# Altium project MBLv1.PrjPcb
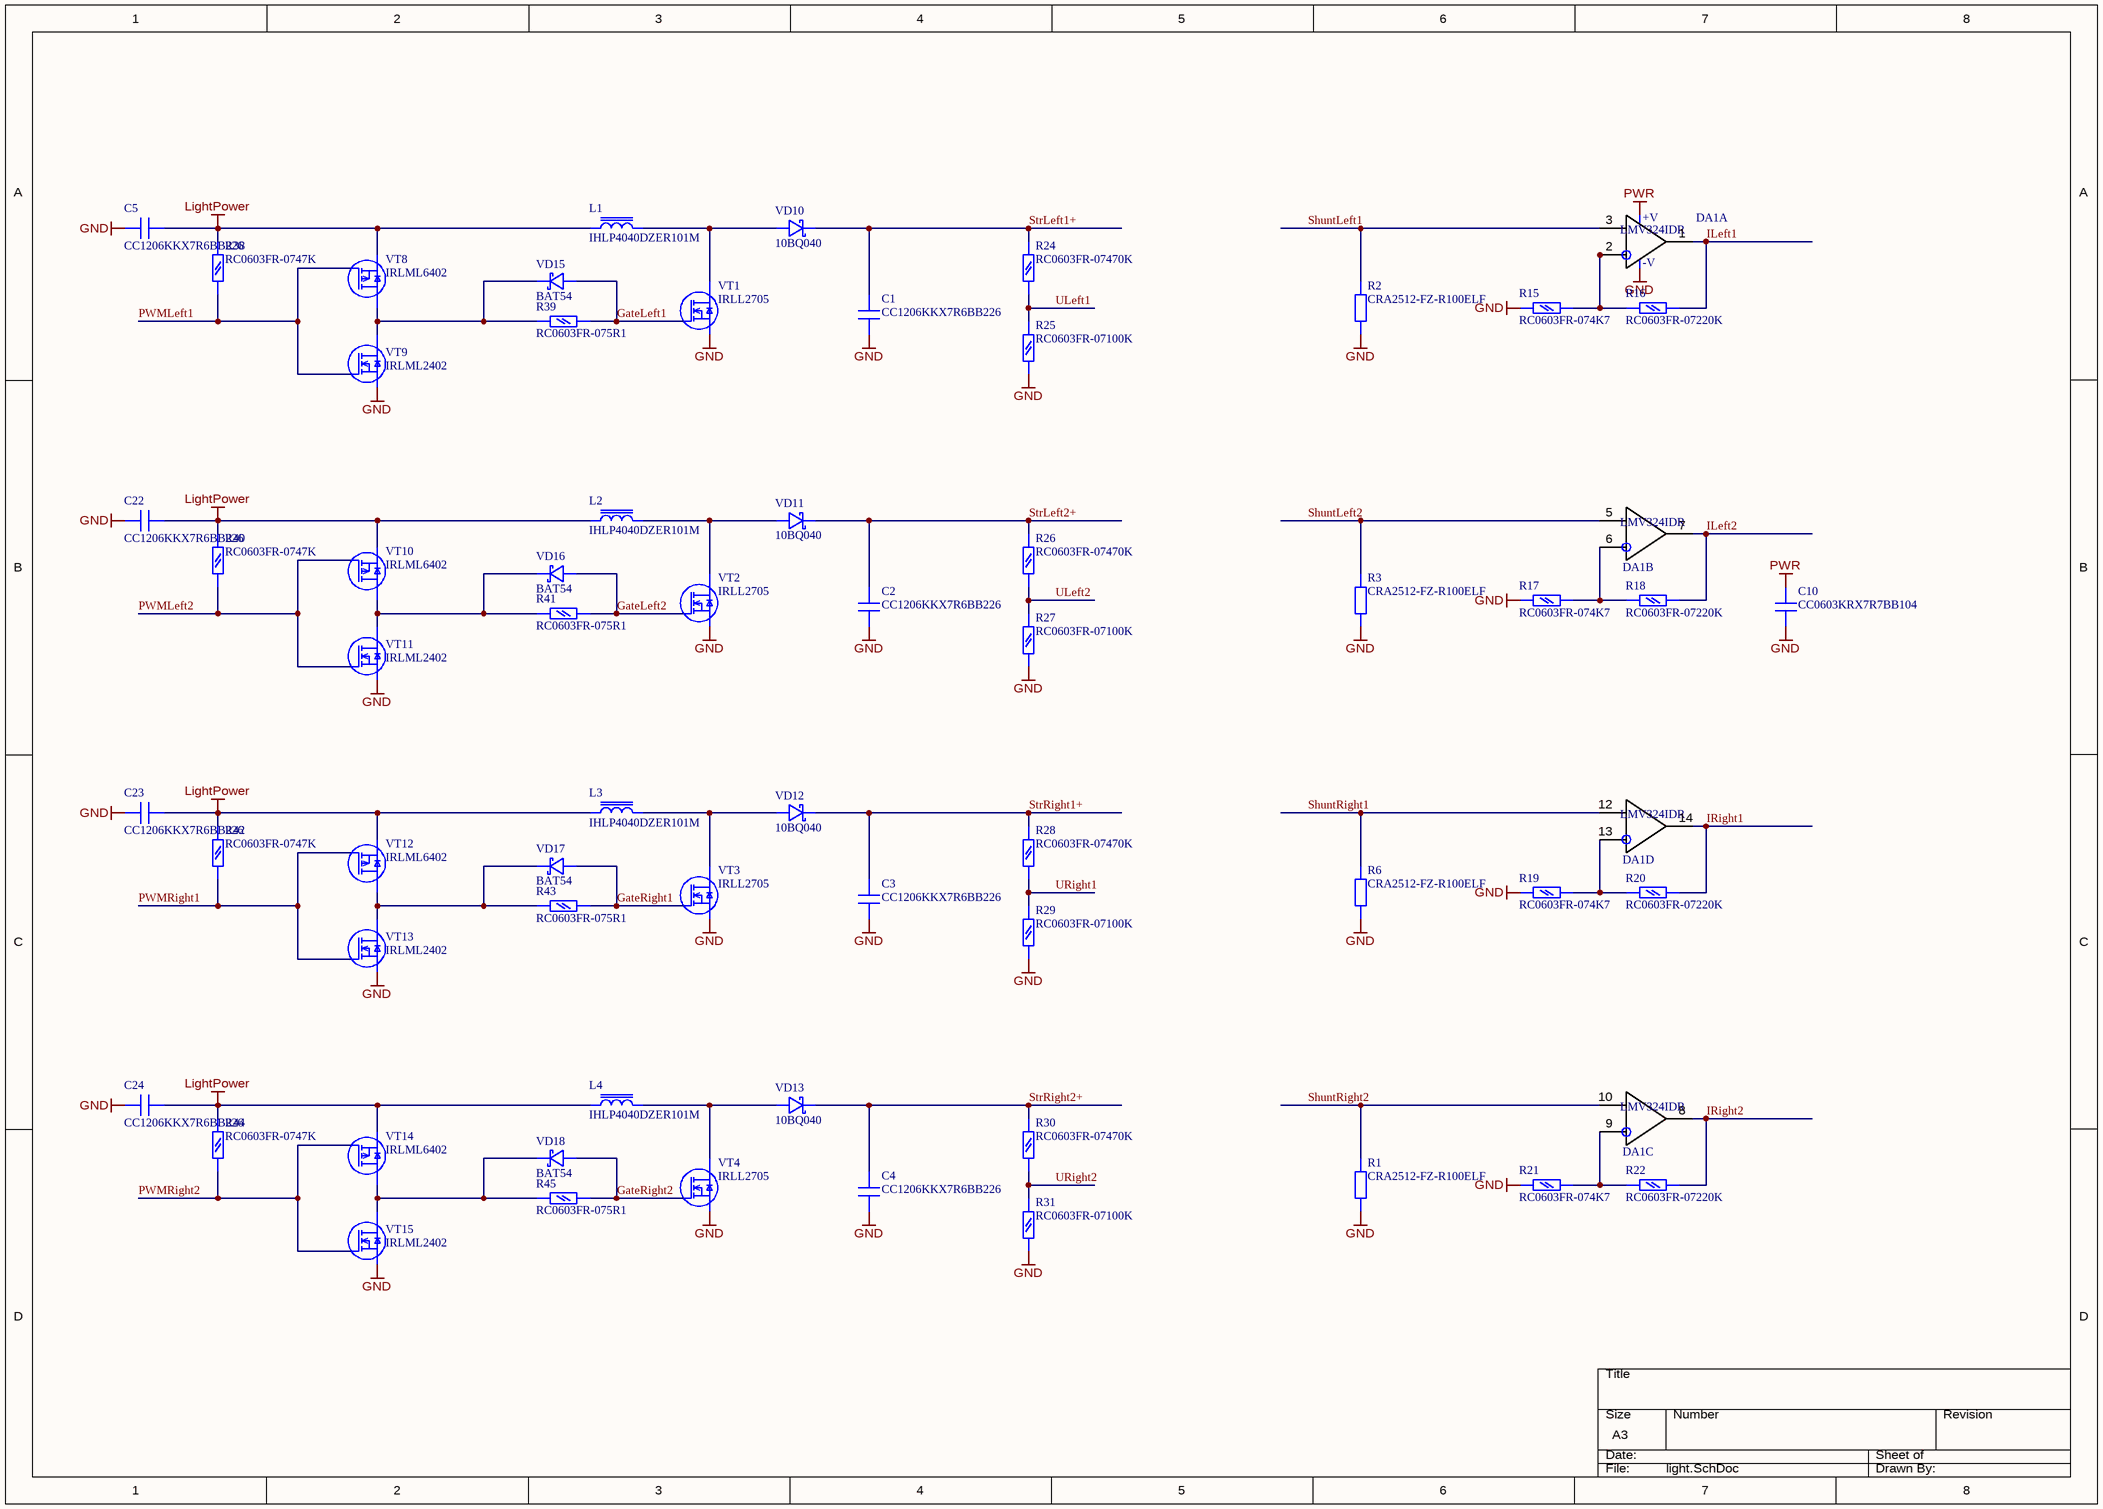
[diagram p0: light.SchDoc]
3 sheets, 110 parts. Net scope: global (net labels, ports and power ports of the same name join across sheets).
Board file: MBLv1.PcbDoc
Sheets:
  light.SchDoc
  control.SchDoc
  charger.SchDoc

## Sheet light.SchDoc
size A3

### Parts
C1  CC1206KKX7R6BB226  [CapacitorSMD1206(reflow)]
C2  CC1206KKX7R6BB226  [CapacitorSMD1206(reflow)]
C3  CC1206KKX7R6BB226  [CapacitorSMD1206(reflow)]
C4  CC1206KKX7R6BB226  [CapacitorSMD1206(reflow)]
C5  CC1206KKX7R6BB226  [CapacitorSMD1206(reflow)]
C10  CC0603KRX7R7BB104  [CapacitorSMD0603(manual)]
C22  CC1206KKX7R6BB226  [CapacitorSMD1206(reflow)]
C23  CC1206KKX7R6BB226  [CapacitorSMD1206(reflow)]
C24  CC1206KKX7R6BB226  [CapacitorSMD1206(reflow)]
DA1  LMV324IDR  [SO14]  (parts A,B,C,D of 4)
L1  IHLP4040DZER101M  [IHLP-4040DZ(manual/deep1.5mm)]
L2  IHLP4040DZER101M  [IHLP-4040DZ(manual/deep1.5mm)]
L3  IHLP4040DZER101M  [IHLP-4040DZ(manual/deep1.5mm)]
L4  IHLP4040DZER101M  [IHLP-4040DZ(manual/deep1.5mm)]
R1  CRA2512-FZ-R100ELF  [ResistorSMD2512(reflow)]
R2  CRA2512-FZ-R100ELF  [ResistorSMD2512(reflow)]
R3  CRA2512-FZ-R100ELF  [ResistorSMD2512(reflow)]
R6  CRA2512-FZ-R100ELF  [ResistorSMD2512(reflow)]
R15  RC0603FR-074K7  [ResistorSMD0603(manual)]
R16  RC0603FR-07220K  [ResistorSMD0603(manual)]
R17  RC0603FR-074K7  [ResistorSMD0603(manual)]
R18  RC0603FR-07220K  [ResistorSMD0603(manual)]
R19  RC0603FR-074K7  [ResistorSMD0603(manual)]
R20  RC0603FR-07220K  [ResistorSMD0603(manual)]
R21  RC0603FR-074K7  [ResistorSMD0603(manual)]
R22  RC0603FR-07220K  [ResistorSMD0603(manual)]
R24  RC0603FR-07470K  [ResistorSMD0603(manual)]
R25  RC0603FR-07100K  [ResistorSMD0603(manual)]
R26  RC0603FR-07470K  [ResistorSMD0603(manual)]
R27  RC0603FR-07100K  [ResistorSMD0603(manual)]
R28  RC0603FR-07470K  [ResistorSMD0603(manual)]
R29  RC0603FR-07100K  [ResistorSMD0603(manual)]
R30  RC0603FR-07470K  [ResistorSMD0603(manual)]
R31  RC0603FR-07100K  [ResistorSMD0603(manual)]
R38  RC0603FR-0747K  [ResistorSMD0603(manual)]
R39  RC0603FR-075R1  [ResistorSMD0603(manual)]
R40  RC0603FR-0747K  [ResistorSMD0603(manual)]
R41  RC0603FR-075R1  [ResistorSMD0603(manual)]
R42  RC0603FR-0747K  [ResistorSMD0603(manual)]
R43  RC0603FR-075R1  [ResistorSMD0603(manual)]
R44  RC0603FR-0747K  [ResistorSMD0603(manual)]
R45  RC0603FR-075R1  [ResistorSMD0603(manual)]
VD10  10BQ040  [SMB_10BQ40]
VD11  10BQ040  [SMB_10BQ40]
VD12  10BQ040  [SMB_10BQ40]
VD13  10BQ040  [SMB_10BQ40]
VD15  BAT54  [SOT23]
VD16  BAT54  [SOT23]
VD17  BAT54  [SOT23]
VD18  BAT54  [SOT23]
VT1  IRLL2705  [SOT223]
VT2  IRLL2705  [SOT223]
VT3  IRLL2705  [SOT223]
VT4  IRLL2705  [SOT223]
VT8  IRLML6402  [SOT23]
VT9  IRLML2402  [SOT23]
VT10  IRLML6402  [SOT23]
VT11  IRLML2402  [SOT23]
VT12  IRLML6402  [SOT23]
VT13  IRLML2402  [SOT23]
VT14  IRLML6402  [SOT23]
VT15  IRLML2402  [SOT23]

### Nets
GND: C1.1 C2.1 C3.1 C4.1 C5.2 C10.1 C22.2 C23.2 C24.2 DA1.11 R1.1 R2.1 R3.1 R6.1 R15.1 R17.1 R19.1 R21.1 R25.1 R27.1 R29.1 R31.1 VT1.3(S) VT2.3(S) VT3.3(S) VT4.3(S) VT9.2(S) VT11.2(S) VT13.2(S) VT15.2(S)
LightPower: C5.1 C22.1 C23.1 C24.1 L1.1 L2.1 L3.1 L4.1 R38.1 R40.1 R42.1 R44.1 VT8.2(S) VT10.2(S) VT12.2(S) VT14.2(S)
PWR: C10.2 DA1.4
GateLeft1: R39.1 VD15.1 VT1.1(G)
GateLeft2: R41.1 VD16.1 VT2.1(G)
GateRight1: R43.1 VD17.1 VT3.1(G)
GateRight2: R45.1 VD18.1 VT4.1(G)
ILeft1: DA1.1 R16.2
ILeft2: DA1.7 R18.2
IRight1: DA1.14 R20.2
IRight2: DA1.8 R22.2
PWMLeft1: R38.2 VT8.1(G) VT9.1(G)
PWMLeft2: R40.2 VT10.1(G) VT11.1(G)
PWMRight1: R42.2 VT12.1(G) VT13.1(G)
PWMRight2: R44.2 VT14.1(G) VT15.1(G)
ShuntLeft1: DA1.3 R2.2
ShuntLeft2: DA1.5 R3.2
ShuntRight1: DA1.12 R6.2
ShuntRight2: DA1.10 R1.2
StrLeft1+: C1.2 R24.2 VD10.2
StrLeft2+: C2.2 R26.2 VD11.2
StrRight1+: C3.2 R28.2 VD12.2
StrRight2+: C4.2 R30.2 VD13.2
ULeft1: R24.1 R25.2
ULeft2: R26.1 R27.2
URight1: R28.1 R29.2
URight2: R30.1 R31.2
NetDA1_2: DA1.2 R15.2 R16.1
NetDA1_6: DA1.6 R17.2 R18.1
NetDA1_9: DA1.9 R21.2 R22.1
NetDA1_13: DA1.13 R19.2 R20.1
NetL1_2: L1.2 VD10.1 VT1.2(D)
NetL2_2: L2.2 VD11.1 VT2.2(D)
NetL3_2: L3.2 VD12.1 VT3.2(D)
NetL4_2: L4.2 VD13.1 VT4.2(D)
NetR39_2: R39.2 VD15.3 VT8.3(D) VT9.3(D)
NetR41_2: R41.2 VD16.3 VT10.3(D) VT11.3(D)
NetR43_2: R43.2 VD17.3 VT12.3(D) VT13.3(D)
NetR45_2: R45.2 VD18.3 VT14.3(D) VT15.3(D)

### Notes on the sheet
- (in symbol OpAmp_Quad_SO14, part A) +V; -V

### Library data of the parts
C1-C5 C22-C24 = CapacitorSMD1206(reflow): CAPACITOR Capacitor SMD 1206 3.2x1.6mm; Описание: Конденсатор SMD 1206; NumberSolderPointsSMD: 0; Аналог: нет; NumberSolderPointsTHT: 0
C10 = CapacitorSMD0603(reflow): CAPACITOR Capacitor SMD 0603 1.6x0.8mm; Описание: Конденсатор SMD 0603; NumberSolderPointsSMD: 0; Аналог: нет; NumberSolderPointsTHT: 0
DA1 = OpAmp_Quad_SO14: IC generic quad op amp SO14; Описание: Микросхема SO14; NumberSolderPointsSMD: 0; Аналог: нет; NumberSolderPointsTHT: 0; x: LMV324ID
L1-L4 = IHLP-4040DZ: MAGNETIC Inductor SMD 4040 h=4mm; Описание: Индуктивность SMD 2525; NumberSolderPointsSMD: 0; Аналог: нет; NumberSolderPointsTHT: 0
R1-R3 R6 = ResistorSMD2512(reflow): RESISTOR Resistor SMD 2512 6.35x3.2mm; Описание: Резистор SMD 2512; NumberSolderPointsSMD: 0; Аналог: нет; NumberSolderPointsTHT: 0
R15-R22 R24-R31 R38-R45 = ResistorSMD0603(reflow): RESISTOR Resistor SMD 0603 1.6x0.8mm; Описание: Резистор SMD 0603; NumberSolderPointsSMD: 0; Аналог: нет; NumberSolderPointsTHT: 0
VD10-VD13 = 10BQ___: DIODE Schottky rectifier; Описание: Диод SMB; NumberSolderPointsSMD: 0; Аналог: нет; x: 10bq015/030/040/060/100; NumberSolderPointsTHT: 0
VD15-VD18 = BAT54: DIODE Schottky barrier diodes; Описание: Диод SOT23; NumberSolderPointsSMD: 0; Аналог: нет; NumberSolderPointsTHT: 0; x: *
VT1-VT4 = MOSFET_N_SOT223: TRANSISTOR MOSFET N generic sot23; Описание: Транзистор SOT223; NumberSolderPointsSMD: 0; Аналог: нет; x: IRLL2705(55v,3.8A,0.04ohm); NumberSolderPointsTHT: 0
VT8 VT10 VT12 VT14 = MOSFET_P_sot23: TRANSISTOR MOSFET P generic sot23; Описание: Транзистор SOT23; NumberSolderPointsSMD: 0; Аналог: нет; NumberSolderPointsTHT: 0; x: IRLML6402
VT9 VT11 VT13 VT15 = MOSFET_N_sot23: TRANSISTOR MOSFET N generic sot23; Описание: Транзистор SOT23; NumberSolderPointsSMD: 0; Аналог: нет; NumberSolderPointsTHT: 0; x: IRLML2402

## Sheet control.SchDoc
size A3
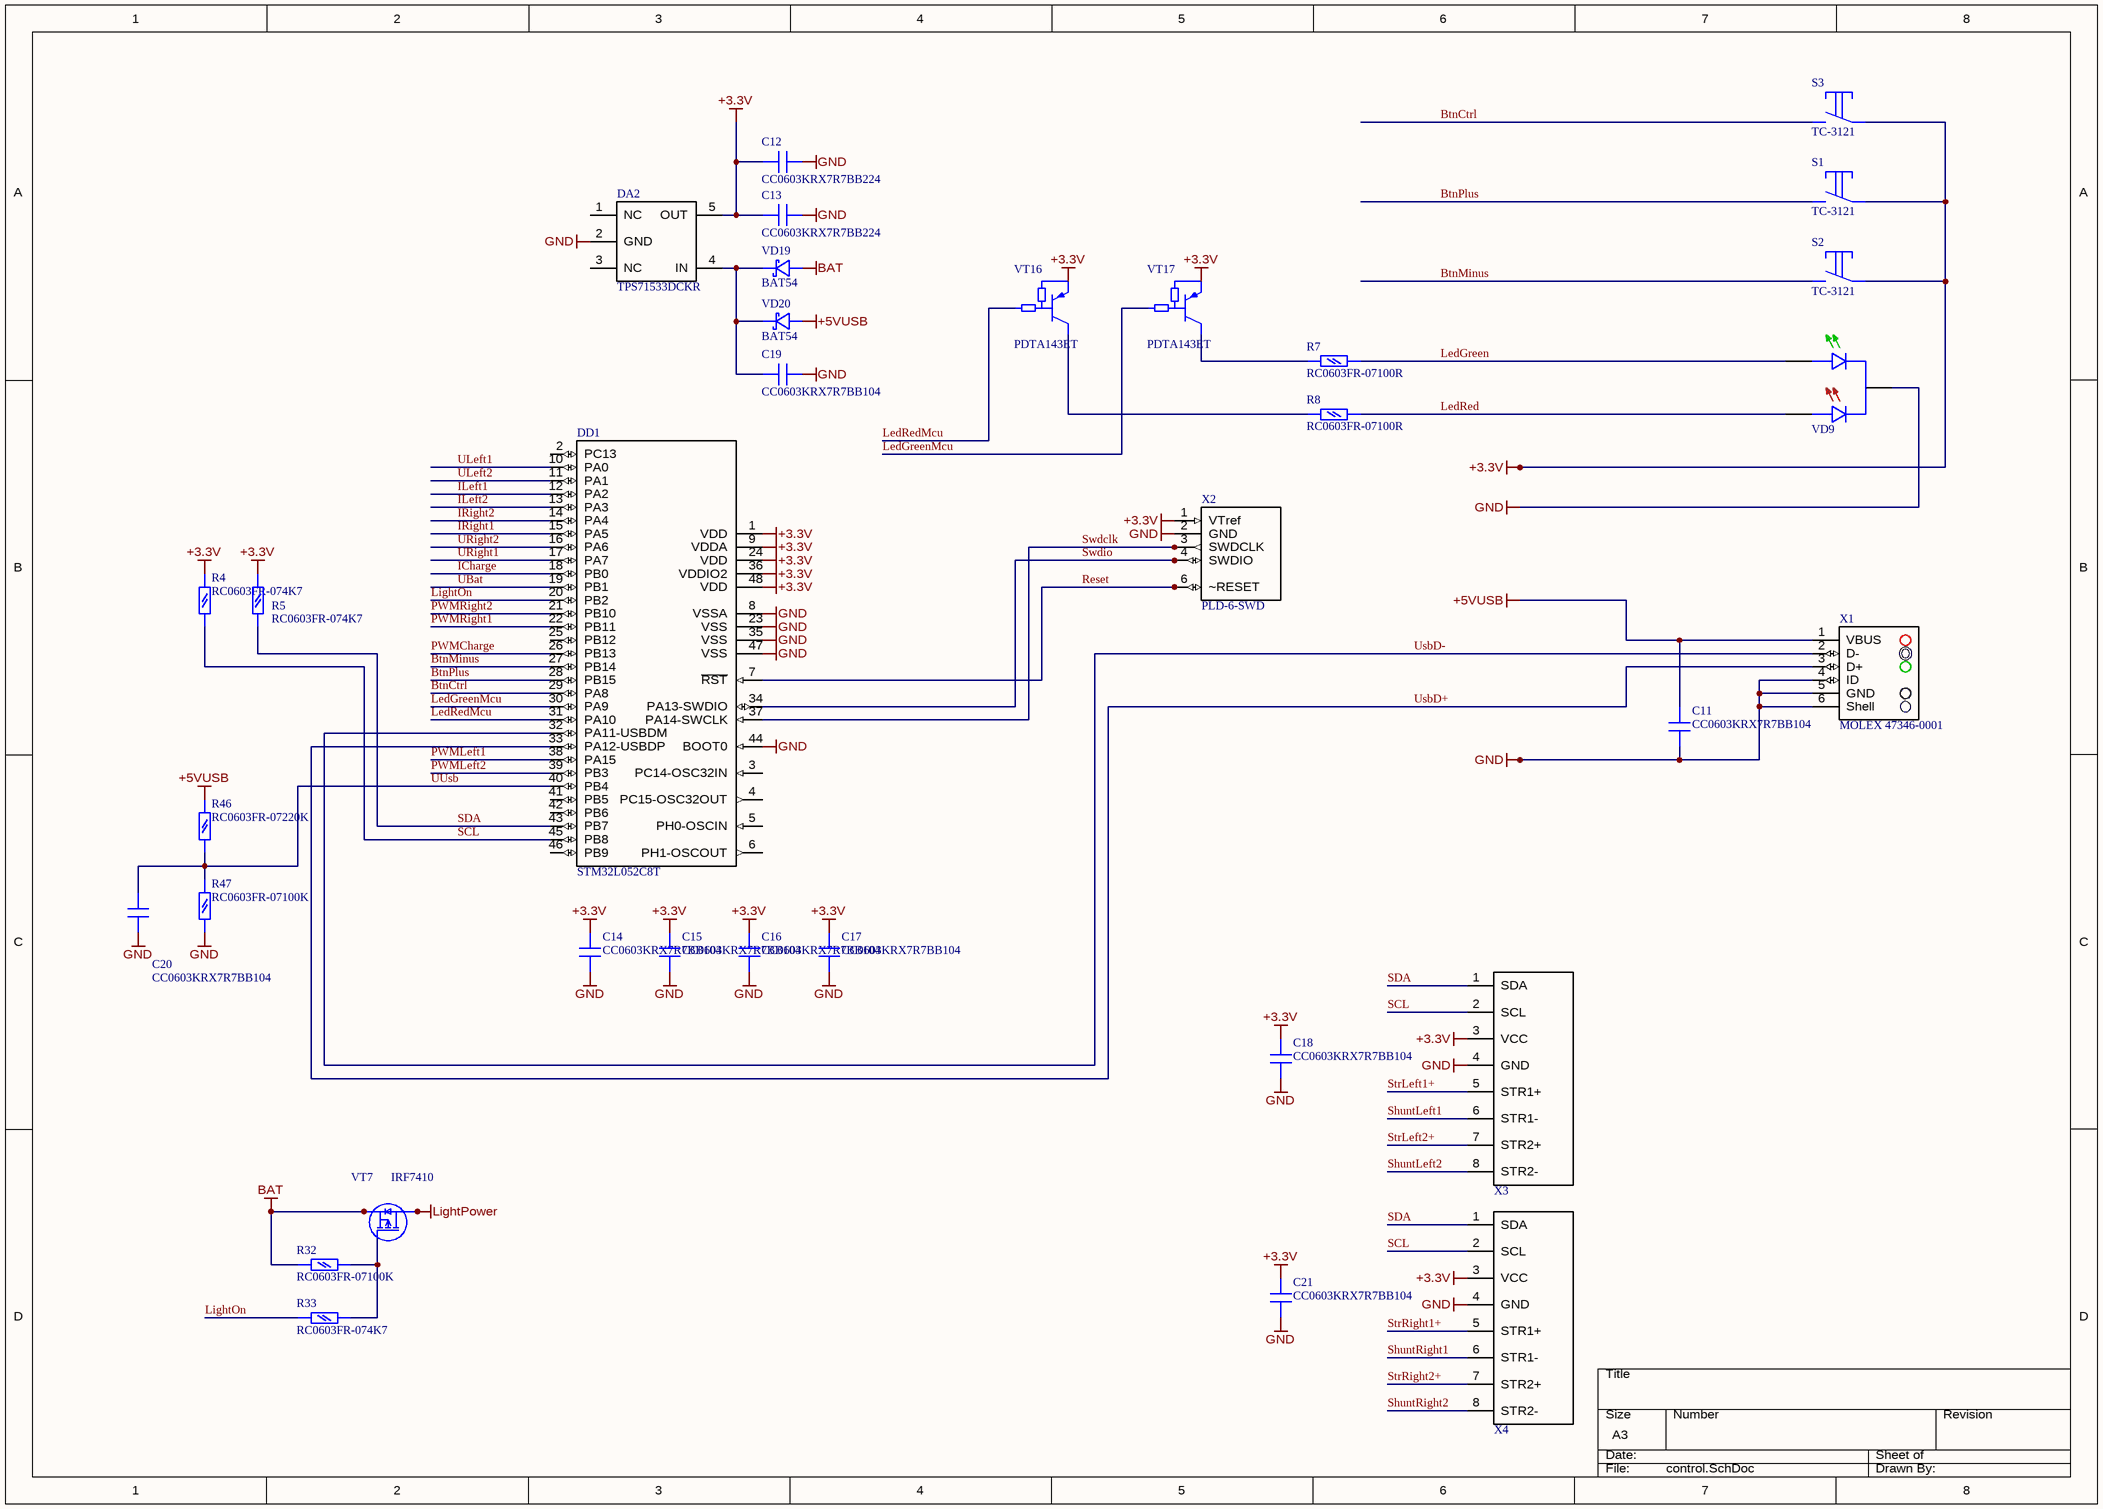
[diagram p1: control.SchDoc]

### Parts
C11  CC0603KRX7R7BB104  [CapacitorSMD0603(manual)]
C12  CC0603KRX7R7BB224  [CapacitorSMD0603(manual)]
C13  CC0603KRX7R7BB224  [CapacitorSMD0603(manual)]
C14  CC0603KRX7R7BB104  [CapacitorSMD0603(manual)]
C15  CC0603KRX7R7BB104  [CapacitorSMD0603(manual)]
C16  CC0603KRX7R7BB104  [CapacitorSMD0603(manual)]
C17  CC0603KRX7R7BB104  [CapacitorSMD0603(manual)]
C18  CC0603KRX7R7BB104  [CapacitorSMD0603(manual)]
C19  CC0603KRX7R7BB104  [CapacitorSMD0603(manual)]
C20  CC0603KRX7R7BB104  [CapacitorSMD0603(manual)]
C21  CC0603KRX7R7BB104  [CapacitorSMD0603(manual)]
DA2  TPS71533DCKR  [SOT323-5]
DD1  STM32L052C8T  [LQFP48_STM32]
R4  RC0603FR-074K7  [ResistorSMD0603(manual)]
R5  RC0603FR-074K7  [ResistorSMD0603(manual)]
R7  RC0603FR-07100R  [ResistorSMD0603(manual)]
R8  RC0603FR-07100R  [ResistorSMD0603(manual)]
R32  RC0603FR-07100K  [ResistorSMD0603(manual)]
R33  RC0603FR-074K7  [ResistorSMD0603(manual)]
R46  RC0603FR-07220K  [ResistorSMD0603(manual)]
R47  RC0603FR-07100K  [ResistorSMD0603(manual)]
S1  TC-3121  [TC-3121(right-angle var1)]
S2  TC-3121  [TC-3121(right-angle var1)]
S3  TC-3121  [TC-3121(right-angle var1)]
VD9  L-119EGWT  [L-119EGWT(rightAngleVar1)]  (value not drawn)
VD19  BAT54  [SOT23]
VD20  BAT54  [SOT23]
VT7  IRF7410  [SO8]
VT16  PDTA143ET  [SOT23]
VT17  PDTA143ET  [SOT23]
X1  MOLEX 47346-0001  [MOLEX 47346-0001]
X2  PLD-6-SWD  [PLD-6-SWD]  (no BOM)
X3  ConnectorMainSide  [ConnectorMainSide]  (value not drawn)  (no BOM)
X4  ConnectorMainSide  [ConnectorMainSide]  (value not drawn)  (no BOM)

### Nets
+3.3V: C12.2 C13.2 C14.2 C15.2 C16.2 C17.2 C18.2 C21.2 DA2.5(OUT) DD1.1(VDD) DD1.9(VDDA) DD1.24(VDD) DD1.36(VDDIO2) DD1.48(VDD) R4.1 R5.1 S1.2 S2.2 S3.2 VT16.2 VT17.2 X2.1(VTref) X3.3(VCC) X4.3(VCC)
+5VUSB: C11.2 R46.1 VD20.1 X1.1(VBUS)
BAT: R32.2 VD19.1 VT7.1(S) VT7.2(S) VT7.3(S)
GND: C11.1 C12.1 C13.1 C14.1 C15.1 C16.1 C17.1 C18.1 C19.1 C20.2 C21.1 DA2.2(GND) DD1.8(VSSA) DD1.23(VSS) DD1.35(VSS) DD1.44(BOOT0) DD1.47(VSS) R47.2 VD9.2 X1.4(ID) X1.5(GND) X1.6(Shell) X2.2(GND) X3.4(GND) X4.4(GND)
LightPower: VT7.5(D) VT7.6(D) VT7.7(D) VT7.8(D)
BtnCtrl: DD1.29(PA8) S3.1
BtnMinus: DD1.27(PB14) S2.1
BtnPlus: DD1.28(PB15) S1.1
ICharge: DD1.18(PB0)
ILeft1: DD1.12(PA2)
ILeft2: DD1.13(PA3)
IRight1: DD1.15(PA5)
IRight2: DD1.14(PA4)
LedGreen: R7.2 VD9.3
LedGreenMcu: DD1.30(PA9) VT17.1
LedRed: R8.2 VD9.1
LedRedMcu: DD1.31(PA10) VT16.1
LightOn: DD1.20(PB2) R33.2
PWMCharge: DD1.26(PB13)
PWMLeft1: DD1.38(PA15)
PWMLeft2: DD1.39(PB3)
PWMRight1: DD1.22(PB11)
PWMRight2: DD1.21(PB10)
Reset: DD1.7(~{RST}) X2.6(~RESET)
SCL: DD1.45(PB8) R4.2 X3.2(SCL) X4.2(SCL)
SDA: DD1.43(PB7) R5.2 X3.1(SDA) X4.1(SDA)
ShuntLeft1: X3.6(STR1-)
ShuntLeft2: X3.8(STR2-)
ShuntRight1: X4.6(STR1-)
ShuntRight2: X4.8(STR2-)
StrLeft1+: X3.5(STR1+)
StrLeft2+: X3.7(STR2+)
StrRight1+: X4.5(STR1+)
StrRight2+: X4.7(STR2+)
Swdclk: DD1.37(PA14-SWCLK) X2.3(SWDCLK)
Swdio: DD1.34(PA13-SWDIO) X2.4(SWDIO)
UBat: DD1.19(PB1)
ULeft1: DD1.10(PA0)
ULeft2: DD1.11(PA1)
URight1: DD1.17(PA7)
URight2: DD1.16(PA6)
UsbD+: DD1.33(PA12-USBDP) X1.3(D+)
UsbD-: DD1.32(PA11-USBDM) X1.2(D-)
UUsb: C20.1 DD1.40(PB4) R46.2 R47.1
NetC19_2: C19.2 DA2.4(IN) VD19.3 VD20.3
NetR7_1: R7.1 VT17.3
NetR8_1: R8.1 VT16.3
NetR32_1: R32.1 R33.1 VT7.4(G)

Not connected (* = marked no-connect by the designer): DA2 1(NC) 3(NC); DD1 2(PC13) 3(PC14-OSC32IN) 4(PC15-OSC32OUT) 5(PH0-OSCIN) 6(PH1-OSCOUT) 25(PB12) 41(PB5) 42(PB6) 46(PB9)

### Library data of the parts
C11-C21 = CapacitorSMD0603(reflow): as C10 on sheet light; NumberSolderPointsTHT: 0
DA2 = TPS715__DCKR: IC LDO; Описание: Микросхема SOT323-5; NumberSolderPointsSMD: 5; NumberSolderPointsTHT: 0; Аналог: нет; x: TPS71525DCKR,TPS71533DCKR,...
DD1 = STM32L052C_T: IC UC/UP; Аналог: нет; x: STM32L052C6T(32kByte flash),STM32L052C8T(64kByte flash); Описание: Микросхема LQFP48
R4 R5 R7 R8 R32 R33 R46 R47 = ResistorSMD0603(reflow): as R15 on sheet light; NumberSolderPointsTHT: 0
S1-S3 = TC-3121: SWITCH Button; Описание: Кнопка; NumberSolderPointsSMD: 0; Аналог: нет; NumberSolderPointsTHT: 0
VD9 = L-119EGWT: Right-angle red/green LED; Описание: Светодиод красный/зеленый; Аналог: *; NumberSolderPointsSMD: *; NumberSolderPointsTHT: *; Комплект: *
VD19 VD20 = BAT54: as VD15 on sheet light; NumberSolderPointsTHT: 0; x: *
VT7 = MOSFET_P_SO8: TRANSISTOR MOSFET P generic SO8; Описание: Транзистор SO8; NumberSolderPointsSMD: 0; NumberSolderPointsTHT: 8; Аналог: нет; x: IRF7410(12v,0.01ohm)
VT16 VT17 = PDTA143ET: TRANSISTOR PNP resistors-equipped transistor sot23; Описание: Транзистор SOT23; NumberSolderPointsSMD: 0; Аналог: нет; NumberSolderPointsTHT: 0
X1 = MOLEX 47346-0001: CONNECTOR USB micro B; Описание: Разъем USB micro; NumberSolderPointsSMD: 0; Аналог: нет; NumberSolderPointsTHT: 0; x: *
X2 = PLD-6-SWD: CONNECTOR PROGRAM 6-pin SWD connector; Описание: Разъем программатора; NumberSolderPointsSMD: 0; Аналог: нет; NumberSolderPointsTHT: 0

## Sheet charger.SchDoc
size A3
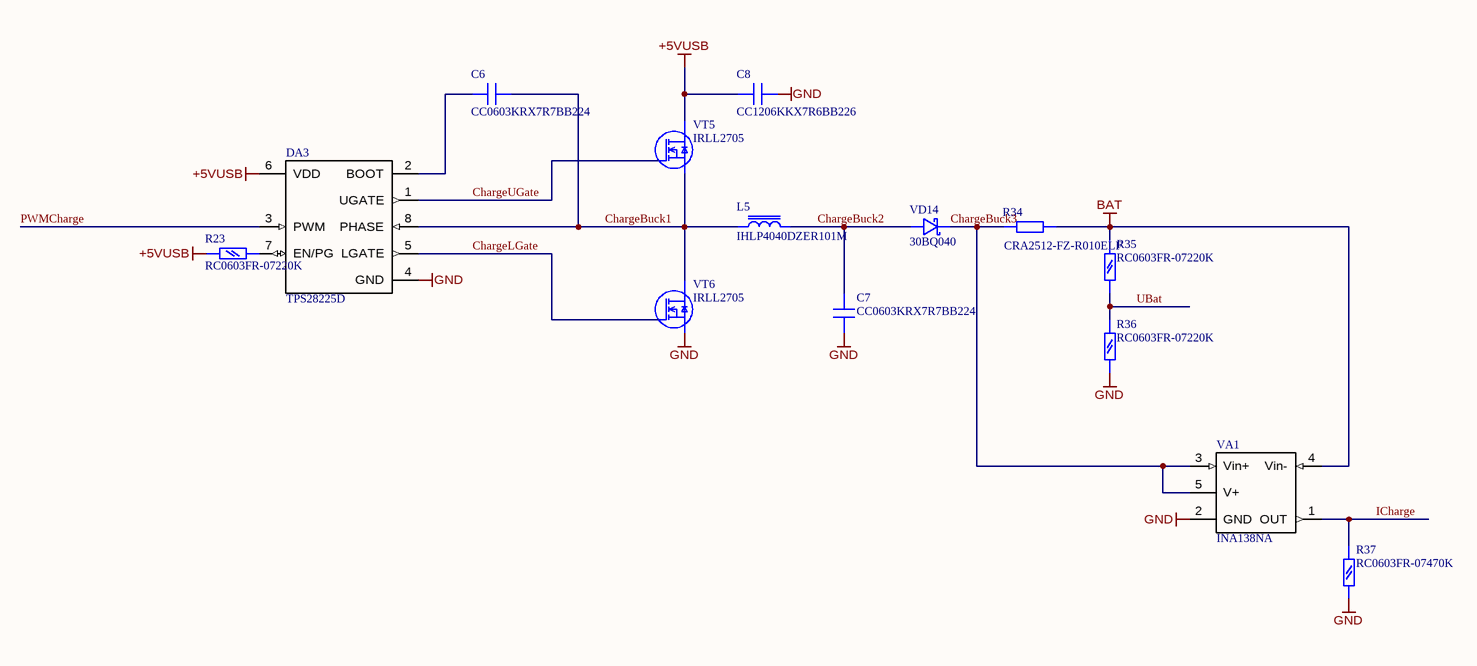
[diagram p2: charger.SchDoc]

### Parts
C6  CC0603KRX7R7BB224  [CapacitorSMD0603(manual)]
C7  CC0603KRX7R7BB224  [CapacitorSMD0603(manual)]
C8  CC1206KKX7R6BB226  [CapacitorSMD1206(reflow)]
DA3  TPS28225D  [SO8]
L5  IHLP4040DZER101M  [IHLP-4040DZ(manual/deep1.5mm)]
R23  RC0603FR-07220K  [ResistorSMD0603(manual)]
R34  CRA2512-FZ-R010ELF  [ResistorSMD2512(reflow)]
R35  RC0603FR-07220K  [ResistorSMD0603(manual)]
R36  RC0603FR-07220K  [ResistorSMD0603(manual)]
R37  RC0603FR-07470K  [ResistorSMD0603(manual)]
VA1  INA138NA  [SOT23-5]
VD14  30BQ040  [SMC]
VT5  IRLL2705  [SOT223]
VT6  IRLL2705  [SOT223]

### Nets
+5VUSB: C8.2 DA3.6(VDD) R23.1 VT5.2(D)
BAT: R34.1 R35.2 VA1.4(Vin-)
GND: C7.1 C8.1 DA3.4(GND) R36.1 R37.1 VA1.2(GND) VT6.3(S)
ChargeBuck1: C6.2 DA3.8(PHASE) L5.1 VT5.3(S) VT6.2(D)
ChargeBuck2: C7.2 L5.2 VD14.1
ChargeBuck3: R34.2 VA1.3(Vin+) VA1.5(V+) VD14.2
ChargeLGate: DA3.5(LGATE) VT6.1(G)
ChargeUGate: DA3.1(UGATE) VT5.1(G)
ICharge: R37.2 VA1.1(OUT)
PWMCharge: DA3.3(PWM)
UBat: R35.1 R36.2
NetC6_1: C6.1 DA3.2(BOOT)
NetDA3_7: DA3.7(EN/PG) R23.2

### Library data of the parts
C6 C7 = CapacitorSMD0603(reflow): as C10 on sheet light; NumberSolderPointsTHT: 0
C8 = CapacitorSMD1206(reflow): as C1 on sheet light; NumberSolderPointsTHT: 0
DA3 = TPS28225D: IC Synchronous MOSFET drivers; Описание: Микросхема SO8; NumberSolderPointsTHT: 0; NumberSolderPointsSMD: 8; x: *; Комплект: *; Аналог: *
L5 = IHLP-4040DZ: as L1 on sheet light; NumberSolderPointsTHT: 0
R23 R35-R37 = ResistorSMD0603(reflow): as R15 on sheet light; NumberSolderPointsTHT: 0
R34 = ResistorSMD2512(reflow): as R1 on sheet light; NumberSolderPointsTHT: 0
VA1 = INA138NA: IC High-Side Current Shunt Monitor 2.7...36V; Описание: Микросхема SOT23-5; NumberSolderPointsSMD: 0; Аналог: нет; x: INA138; NumberSolderPointsTHT: 0
VD14 = 30BQ___: DIODE Schottky rectifier; Описание: Диод SMC; NumberSolderPointsSMD: 0; Аналог: нет; x: 30bq040 30bq060 30bq100; NumberSolderPointsTHT: 0
VT5 VT6 = MOSFET_N_SOT223: as VT1 on sheet light; NumberSolderPointsTHT: 0

## Nets that join several sheets
+5VUSB: control (C11.2 R46.1 VD20.1 X1.1), charger (C8.2 DA3.6 R23.1 VT5.2)
BAT: control (5 pins), charger (R34.1 R35.2 VA1.4)
GND: light (30 pins), control (25 pins), charger (7 pins)
LightPower: light (16 pins), control (VT7.5 VT7.6 VT7.7 VT7.8)
ICharge: control (DD1.18), charger (R37.2 VA1.1)
ILeft1: light (DA1.1 R16.2), control (DD1.12)
ILeft2: light (DA1.7 R18.2), control (DD1.13)
IRight1: light (DA1.14 R20.2), control (DD1.15)
IRight2: light (DA1.8 R22.2), control (DD1.14)
PWMCharge: control (DD1.26), charger (DA3.3)
PWMLeft1: light (R38.2 VT8.1 VT9.1), control (DD1.38)
PWMLeft2: light (R40.2 VT10.1 VT11.1), control (DD1.39)
PWMRight1: light (R42.2 VT12.1 VT13.1), control (DD1.22)
PWMRight2: light (R44.2 VT14.1 VT15.1), control (DD1.21)
ShuntLeft1: light (DA1.3 R2.2), control (X3.6)
ShuntLeft2: light (DA1.5 R3.2), control (X3.8)
ShuntRight1: light (DA1.12 R6.2), control (X4.6)
ShuntRight2: light (DA1.10 R1.2), control (X4.8)
StrLeft1+: light (C1.2 R24.2 VD10.2), control (X3.5)
StrLeft2+: light (C2.2 R26.2 VD11.2), control (X3.7)
StrRight1+: light (C3.2 R28.2 VD12.2), control (X4.5)
StrRight2+: light (C4.2 R30.2 VD13.2), control (X4.7)
UBat: control (DD1.19), charger (R35.1 R36.2)
ULeft1: light (R24.1 R25.2), control (DD1.10)
ULeft2: light (R26.1 R27.2), control (DD1.11)
URight1: light (R28.1 R29.2), control (DD1.17)
URight2: light (R30.1 R31.2), control (DD1.16)